# EAGLE board Controller-Board_Rack-PDU_1.0 (EAGLE 9.6.2)
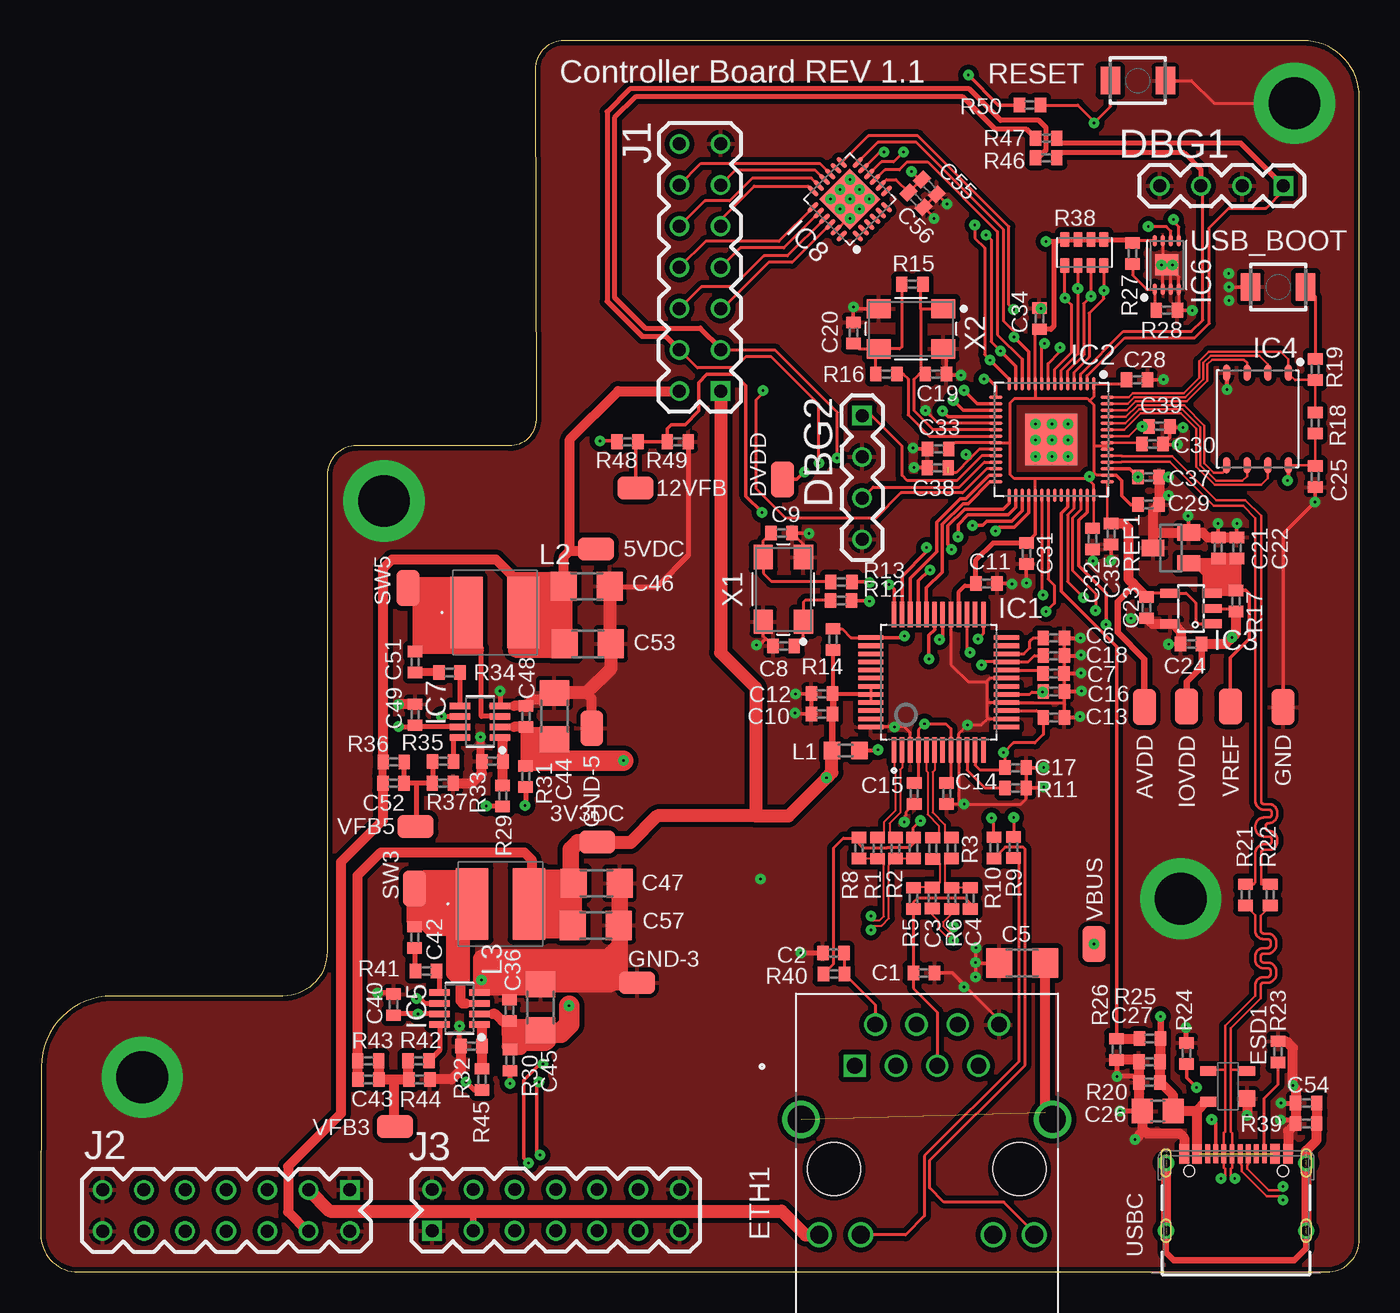
[diagram p3: board, top side]
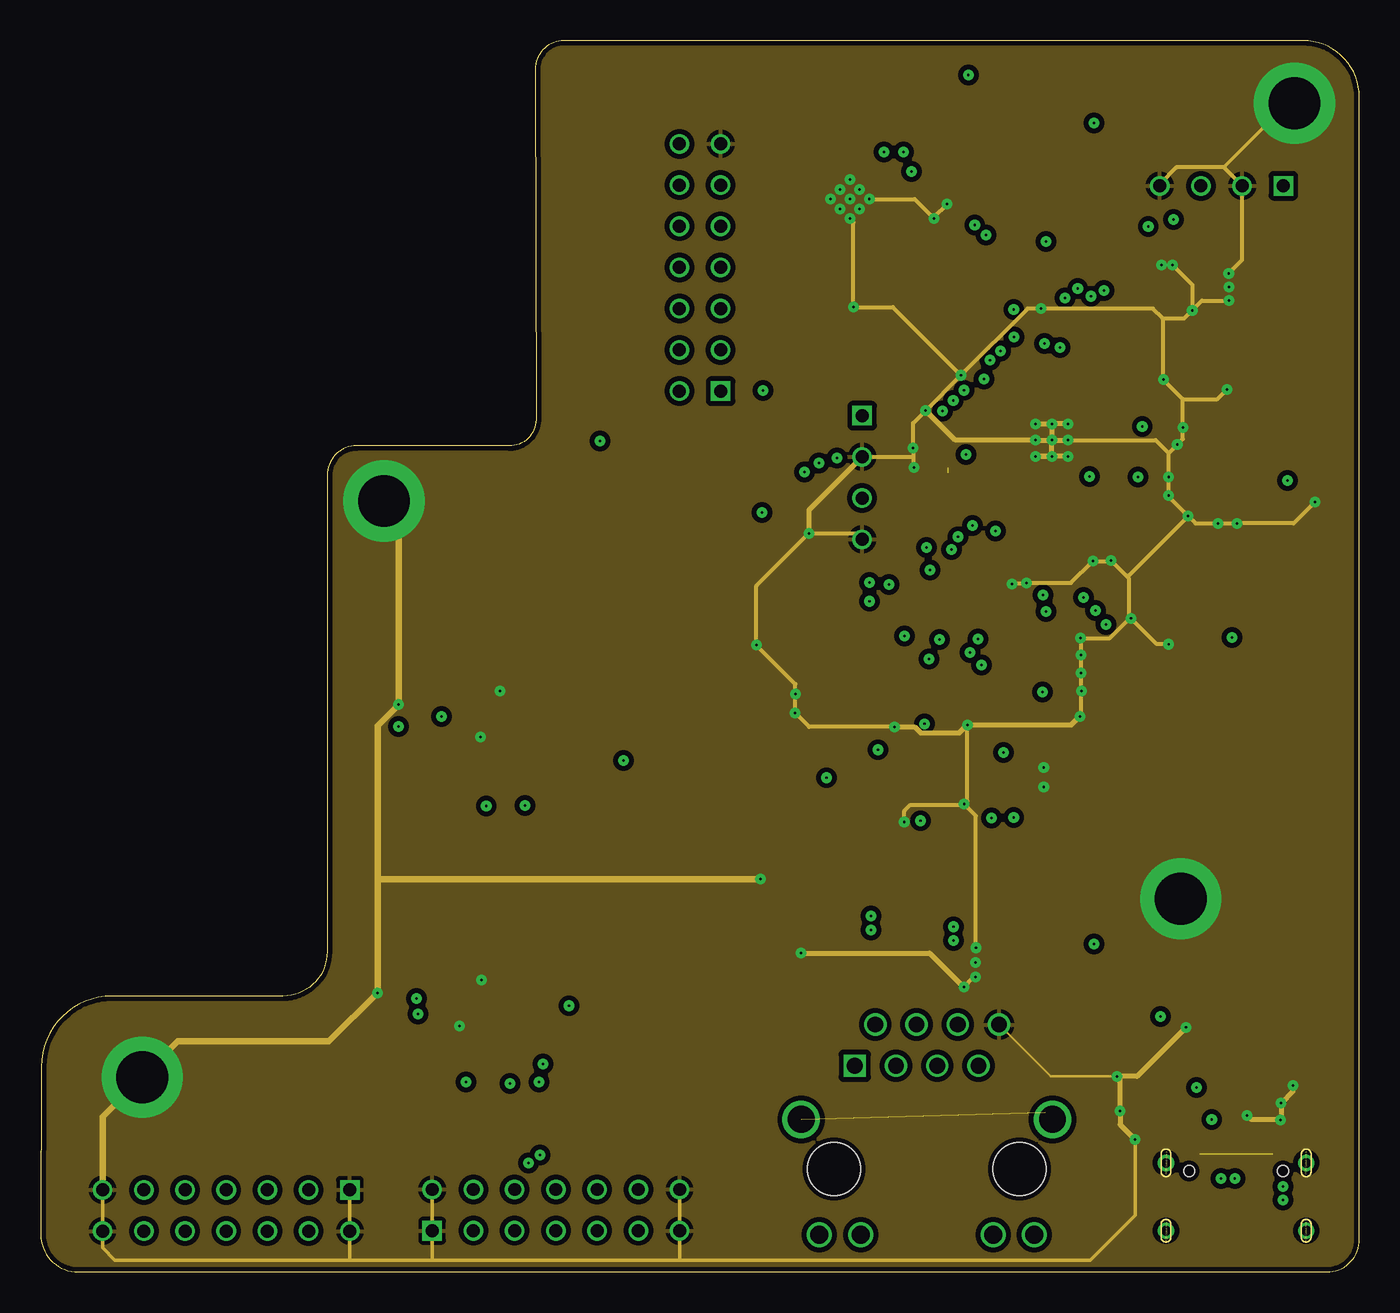
[diagram p4: board, inner layer Route2]
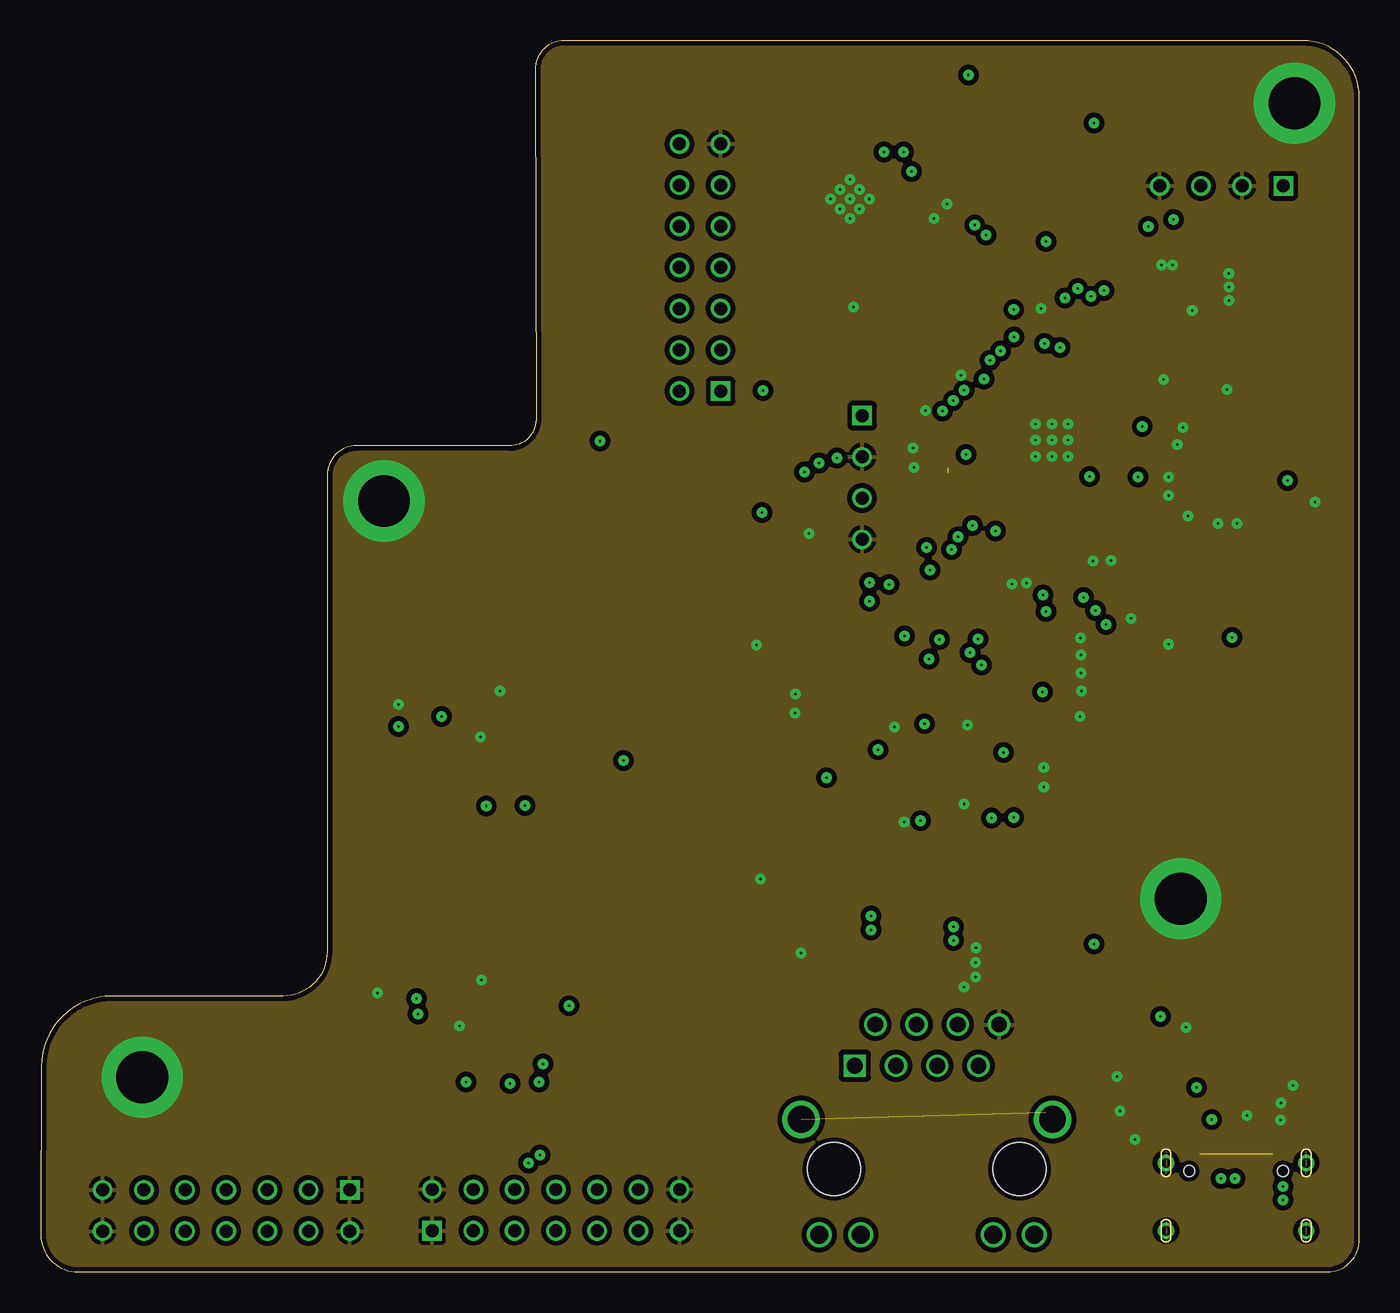
[diagram p5: board, inner layer Route15]
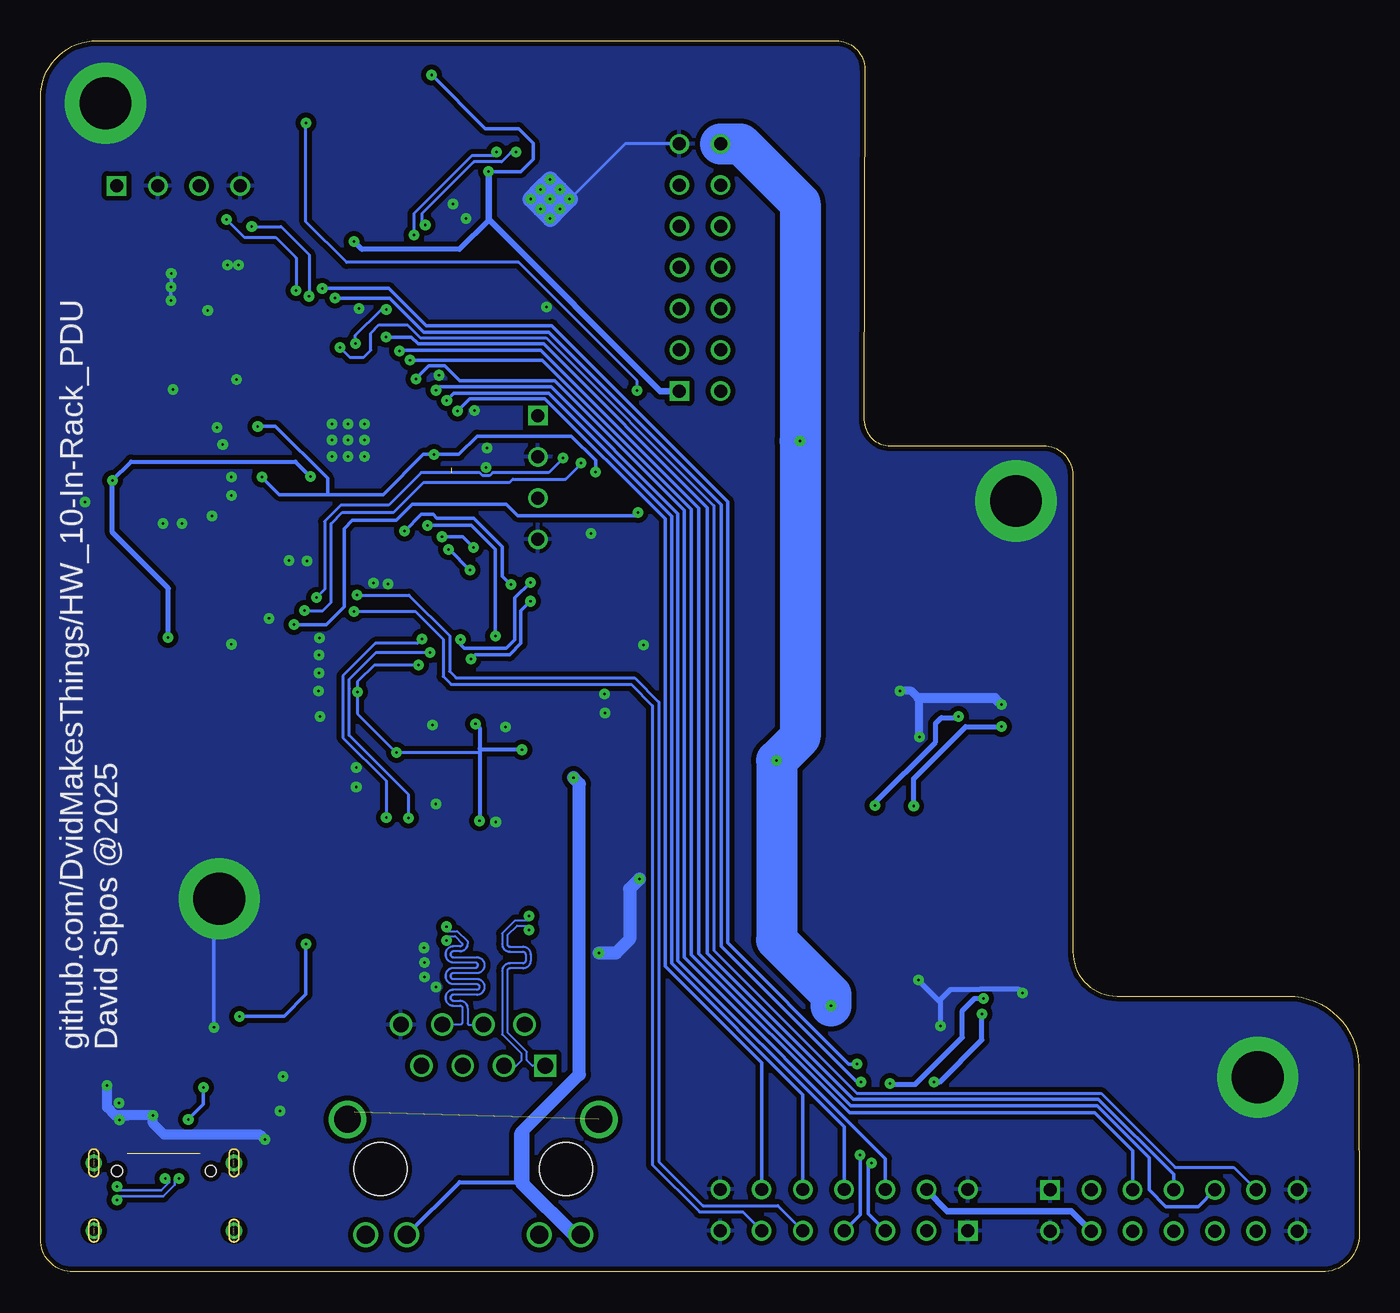
[diagram p6: board, bottom side, seen from below]

Size 81.26 x 75.87 mm. Coordinates in mm from the lower left corner, seen from the top.
Outline: 19.46,50.9 arc90 17.66,49.09 17.66,19.73 arc-90 14.93,17 4.41,17 arc90 0.05,12.65 0.01,2.31 0,2.31 arc90 2.31,0 79.26,0 arc90 81.26,2 81.26,72.39 arc90 77.78,75.87 32.24,75.87 arc90 30.48,74.11 30.53,52.5 arc-90 28.88,50.9 19.46,50.9
Copper layers (1+2*15+16): Top 0.035mm / dielectric 0.15mm / Route2 0.0175mm / dielectric 1.265mm / Route15 0.0175mm / dielectric 0.15mm / Bottom 0.035mm
Design rules "4layers *": minimum track width 3.5mil, minimum drill 0.15mm, track to track 3.5mil, track to pad 3.5mil, pad to pad 3.5mil, via to via 3.5mil, smd to smd 3.5mil, copper to edge 0.2mm, drill to drill 6mil, minimum pad ring 8mil, minimum via ring 0.25mm, stop-mask expansion 0.05mm, vias tented up to drill 16mil, thermal gap 10mil
Net classes: 1 100R_DIFFPAIR: width 0.121 mm, drill 0.15 mm, clearance 0.191 mm; 2 90R_DIFFPAIR: width 0.155 mm, drill 0.15 mm, clearance 0.191 mm

## Footprints (pad centres in the part's own frame; a part is rotated, then mirrored left to right if it is on the bottom)
TP = smd 2.2 x 1.4: TP 0,0
C0402 = smd 0.7 x 0.9: 1 -0.65,0; 2 0.65,0
C1206 = smd 1.6 x 1.803: 1 -1.422,0; 2 1.422,0
0805 = smd 1.3 x 1.5: 1 -0.95,0; 2 0.95,0
0402 = smd 0.7 x 0.9: 1 -0.65,0; 2 0.65,0
1X4 = drill 0.8 square: 1 0,3.81 | drill 0.8: 2 0,1.27; 3 0,-1.27; 4 0,-3.81
SOT143 = smd 1 x 1: 1 -0.75,-1.2 | smd 0.6 x 1: 2 0.95,-1.2; 3 0.95,1.2; 4 -0.95,1.2
RJ45-CAT5 = drill 0.97 square: 1 -4.445,6.35 | drill 0.97: 2 -3.175,8.89; 3 -1.905,6.35; 4 -0.635,8.89; 5 0.635,6.35; 6 1.905,8.89; 7 3.175,6.35; 8 4.445,8.89 | drill 1.1: 9 -6.625,-4.06; 10 -4.085,-4.06; 11 4.085,-4.06; 12 6.625,-4.06 | drill 1.65: S1 -7.745,3.05; S2 7.745,3.05 | hole 3.25: 5.715,0; -5.715,0
LQFP48 = smd 1.56 x 0.28: 1 -4.18,2.75; 2 -4.18,2.25; 3 -4.18,1.75; 4 -4.18,1.25; 5 -4.18,0.75; 6 -4.18,0.25; 7 -4.18,-0.25; 8 -4.18,-0.75; 9 -4.18,-1.25; 10 -4.18,-1.75; 11 -4.18,-2.25; 12 -4.18,-2.75; 25 4.18,-2.75; 26 4.18,-2.25; 27 4.18,-1.75; 28 4.18,-1.25; 29 4.18,-0.75; 30 4.18,-0.25; 31 4.18,0.25; 32 4.18,0.75; 33 4.18,1.25; 34 4.18,1.75; 35 4.18,2.25; 36 4.18,2.75 | smd 0.28 x 1.56: 13 -2.75,-4.18; 14 -2.25,-4.18; 15 -1.75,-4.18; 16 -1.25,-4.18; 17 -0.75,-4.18; 18 -0.25,-4.18; 19 0.25,-4.18; 20 0.75,-4.18; 21 1.25,-4.18; 22 1.75,-4.18; 23 2.25,-4.18; 24 2.75,-4.18; 37 2.75,4.18; 38 2.25,4.18; 39 1.75,4.18; 40 1.25,4.18; 41 0.75,4.18; 42 0.25,4.18; 43 -0.25,4.18; 44 -0.75,4.18; 45 -1.25,4.18; 46 -1.75,4.18; 47 -2.25,4.18; 48 -2.75,4.18
QFN40P700X700X100-57T510 = smd 0.837 x 0.22: 1 -3.437,2.6; 2 -3.437,2.2; 3 -3.437,1.8; 4 -3.437,1.4; 5 -3.437,1; 6 -3.437,0.6; 7 -3.437,0.2; 8 -3.437,-0.2; 9 -3.437,-0.6; 10 -3.437,-1; 11 -3.437,-1.4; 12 -3.437,-1.8; 13 -3.437,-2.2; 14 -3.437,-2.6; 29 3.437,-2.6; 30 3.437,-2.2; 31 3.437,-1.8; 32 3.437,-1.4; 33 3.437,-1; 34 3.437,-0.6; 35 3.437,-0.2; 36 3.437,0.2; 37 3.437,0.6; 38 3.437,1; 39 3.437,1.4; 40 3.437,1.8; 41 3.437,2.2; 42 3.437,2.6 | smd 0.22 x 0.837: 15 -2.6,-3.437; 16 -2.2,-3.437; 17 -1.8,-3.437; 18 -1.4,-3.437; 19 -1,-3.437; 20 -0.6,-3.437; 21 -0.2,-3.437; 22 0.2,-3.437; 23 0.6,-3.437; 24 1,-3.437; 25 1.4,-3.437; 26 1.8,-3.437; 27 2.2,-3.437; 28 2.6,-3.437; 43 2.6,3.437; 44 2.2,3.437; 45 1.8,3.437; 46 1.4,3.437; 47 1,3.437; 48 0.6,3.437; 49 0.2,3.437; 50 -0.2,3.437; 51 -0.6,3.437; 52 -1,3.437; 53 -1.4,3.437; 54 -1.8,3.437; 55 -2.2,3.437; 56 -2.6,3.437 | smd 3.2 x 3.2: 57 0,0
SOT23-5 = smd 0.55 x 1.2: 1 -0.95,-1.3; 2 0,-1.3; 3 0.95,-1.3; 4 0.95,1.3; 5 -0.95,1.3
SON127P600X500X75-8N = smd 1.012 x 0.432: 1 -2.85,1.905; 2 -2.85,0.635; 3 -2.85,-0.635; 4 -2.85,-1.905; 5 2.85,-1.905; 6 2.85,-0.635; 7 2.85,0.635; 8 2.85,1.905
SOT65P280X110-8N = smd 1.259 x 0.4: 1 -1.228,0.975; 2 -1.228,0.325; 3 -1.228,-0.325; 4 -1.228,-0.975; 5 1.228,-0.975; 6 1.228,-0.325; 7 1.228,0.325; 8 1.228,0.975
SON50P300X200X50-9T130X140N = smd 0.711 x 0.27: 1 -1.501,0.75; 2 -1.501,0.25; 3 -1.501,-0.25; 4 -1.501,-0.75; 5 1.501,-0.75; 6 1.501,-0.25; 7 1.501,0.25; 8 1.501,0.75 | smd 1.3 x 1.4: 9 0,0
QFN50P400X400X100-25T265 = smd 0.811 x 0.264: 1 -1.951,1.25; 2 -1.951,0.75; 3 -1.951,0.25; 4 -1.951,-0.25; 5 -1.951,-0.75; 6 -1.951,-1.25; 13 1.951,-1.25; 14 1.951,-0.75; 15 1.951,-0.25; 16 1.951,0.25; 17 1.951,0.75; 18 1.951,1.25 | smd 0.264 x 0.811: 7 -1.25,-1.951; 8 -0.75,-1.951; 9 -0.25,-1.951; 10 0.25,-1.951; 11 0.75,-1.951; 12 1.25,-1.951; 19 1.25,1.951; 20 0.75,1.951; 21 0.25,1.951; 22 -0.25,1.951; 23 -0.75,1.951; 24 -1.25,1.951 | smd 2.65 x 2.65: 25 0,0
2X7 = drill 0.8 square: 1 -1.27,7.62 | drill 0.8: 2 1.27,7.62; 3 -1.27,5.08; 4 1.27,5.08; 5 -1.27,2.54; 6 1.27,2.54; 7 -1.27,0; 8 1.27,0; 9 -1.27,-2.54; 10 1.27,-2.54; 11 -1.27,-5.08; 12 1.27,-5.08; 13 -1.27,-7.62; 14 1.27,-7.62
0603 = smd 1 x 1.1: 1 -0.85,0; 2 0.85,0
SRR5228A = smd 4.4 x 2: 1 0,1.75; 2 0,-1.75
742C083103JP = smd 0.59 x 0.92: 1 -1.2,-0.8; 2 -0.4,-0.8; 3 0.4,-0.8; 4 1.2,-0.8; 5 1.2,0.8; 6 0.4,0.8; 7 -0.4,0.8; 8 -1.2,0.8
SOT23 = smd 1 x 1.4: 1 -0.95,-1.1; 2 0.95,-1.1; 3 0,1.1
SWITCH-OMRON_B3U-1000P = smd 1.2 x 1.7: 1 -1.7,0; 2 1.7,0
629722000214 = smd 0.3 x 1.15: A1 -3.35,4.745; A4 -2.55,4.745; A5 -1.25,4.745; A6 -0.25,4.745; A7 0.25,4.745; A8 1.25,4.745; A9 2.55,4.745; A12 3.35,4.745; B1 3.05,4.745; B4 2.25,4.745; B5 1.75,4.745; B6 0.75,4.745; B7 -0.75,4.745; B8 -1.75,4.745; B9 -2.25,4.745; B12 -3.05,4.745 | drill 0.6 pad 1: S1 -4.32,4.18; S2 4.32,4.18; S3 -4.32,0; S4 4.32,0 | hole 0.65: -2.89,3.68; 2.89,3.68
OSCCC500X320X130 = smd 1.487 x 1.187: 1 -1.988,-1.238; 2 1.988,-1.238; 3 1.988,1.238; 4 -1.988,1.238

## Placement (x,y rotation side)
3V3DC  TP  [TP]  34.3,26.49 180 top
5VDC  TP  [TP]  34.23,44.55 0 top
12VFB  TP  [TP]  36.66,48.3 0 top
AVDD  TP  [TP]  68.01,34.81 270 top
C1  100nF  [C0402]  54.43,18.42 0 top
C2  22nF  [C0402]  48.85,19.64 180 top
C3  6.8nF  [C0402]  54.94,23.04 270 top
C4  6.8nF  [C0402]  56.14,23.02 270 top
C5  C1206C102KGRACTM  [C1206]  60.48,19.03 0 top
C6  100nF  [C0402]  62.43,39.07 0 top
C7  4.7uF  [C0402]  62.41,36.88 0 top
C8  18pF  [C0402]  45.78,38.57 180 top
C9  18pF  [C0402]  45.65,45.53 0 top
C10  100nF  [C0402]  48.14,34.38 180 top
C11  100nF  [C0402]  58.28,42.42 0 top
C12  100nF  [C0402]  48.14,35.63 180 top
C13  100nF  [C0402]  62.43,34.17 0 top
C14  100nF  [C0402]  55.83,29.48 270 top
C15  100nF  [C0402]  53.83,29.48 270 top
C16  100nF  [C0402]  62.43,35.77 0 top
C17  100nF  [C0402]  60.08,31.07 0 top
C18  100nF  [C0402]  62.43,37.97 0 top
C19  15pF  [C0402]  55.16,55.32 0 top
C20  15pF  [C0402]  50.08,57.86 90 top
C21  1uF  [C0402]  72.57,44.61 90 top
C22  100nF  [C0402]  73.71,44.61 90 top
C23  100nF  [C0402]  68.15,40.93 270 top
C24  100nF  [C0402]  70.89,38.69 180 top
C25  100nF  [C0402]  78.54,49 270 top
C26  10uF  [0805]  68.83,9.91 180 top
C27  100nF  [0402]  68.33,12.95 180 top
C28  100nF  [C0402]  67.56,54.97 0 top
C29  100nF  [C0402]  68.27,47.28 0 top
C30  100nF  [C0402]  68.5,51.01 0 top
C31  100nF  [C0402]  60.74,44.27 270 top
C32  100nF  [C0402]  64.82,45.17 270 top
C33  100nF  [C0402]  55.3,50.72 180 top
C34  100nF  [C0402]  61.54,58.73 90 top
C35  100nF  [C0402]  65.96,45.47 270 top
C36  100nF  [0402]  28.9,16.12 90 top
C37  100nF  [C0402]  68.27,48.98 0 top
C38  100nF  [C0402]  55.28,49.55 180 top
C39  100nF  [C0402]  68.93,52.1 0 top
C40  100nF  [0402]  21.75,16.47 90 top
C42  100nF  [0402]  23.05,20.62 90 top
C43  33pF  [0402]  20.2,11.86 0 top
C44  CL31A226KAHNNNE - 22uF 25V  [C1206]  31.66,34.25 90 top
C45  CL31A226KAHNNNE - 22uF 25V  [C1206]  30.81,16.3 90 top
C46  CL31A226KPHNNNE - 22uF - 10V  [C1206]  33.66,42.25 0 top
C47  CL31A226KPHNNNE - 22uF - 10V  [C1206]  34.26,23.95 0 top
C48  100nF  [0402]  29.91,34.23 90 top
C49  100nF  [0402]  23.08,34.33 90 top
C51  100nF  [0402]  23.08,37.58 90 top
C52  33pF  [0402]  21.74,30.11 0 top
C53  CL31A226KPHNNNE - 22uF - 10V  [C1206]  33.71,38.7 0 top
C54  4.7nF  [0402]  77.98,10.41 180 top
C55  100nF  [C0402]  54.76,66.86 315 top
C56  100nF  [C0402]  53.94,66.06 315 top
C57  CL31A226KPHNNNE - 22uF - 10V  [C1206]  34.21,21.35 0 top
DBG1  [1X4]  72.77,66.92 270 top
DBG2  [1X4]  50.62,48.95 0 top
DVDD  TP  [TP]  45.71,48.83 90 top
ESD1  SP0503BAHTG-ES  [SOT143]  73.15,11.43 90 top
ETH1  SI-60118-F  [RJ45-CAT5]  54.61,6.35 0 top
GND  TP  [TP]  76.56,34.8 270 top
GND-3  TP  [TP]  36.75,17.82 180 top
GND-5  TP  [TP]  33.96,33.5 270 top
IC1  W5500  [LQFP48]  55.33,36.33 90 top
IC2  RP2040  [QFN40P700X700X100-57T510]  62.28,51.29 270 top
IC3  MCP6001R  [SOT23-5]  70.89,40.88 90 top
IC4  W25Q128JVPIQ  [SON127P600X500X75-8N]  74.98,52.56 270 top
IC5  MP2315S  [SOT65P280X110-8N]  25.81,16.23 180 top
IC6  CAT24C256HU4IGT3  [SON50P300X200X50-9T130X140N]  69.39,62.05 90 top
IC7  MP2315GJ-Z  [SOT65P280X110-8N]  27.08,33.91 180 top
IC8  MCP23S18-E/MJ  [QFN50P400X400X100-25T265]  49.86,66.1 135 top
IOVDD  TP  [TP]  70.61,34.85 270 top
J1  [2X7]  40.63,61.89 180 top
J2  [2X7]  11.44,3.79 270 top
J3  [2X7]  31.75,3.81 90 top
L1  BLM18EG221TN1D  [0603]  49.61,32.13 0 top
L2  4.9uH  [SRR5228A]  27.99,40.63 90 top
L3  4.2uH  [SRR5228A]  28.34,22.68 90 top
R1  3.3R  [0402]  51.57,26.11 270 top
R2  3.3R  [0402]  52.67,26.11 270 top
R3  3.3R  [0402]  56.12,26.12 270 top
R4  3.3R  [0402]  54.97,26.1 270 top
R5  49.9R  [C0402]  53.78,23.02 90 top
R6  49.9R  [C0402]  57.28,23.02 90 top
R7  49.9R  [0402]  53.78,26.12 90 top
R8  49.9R  [0402]  50.43,26.12 90 top
R9  470R  [0402]  59.94,26.16 270 top
R10  470R  [0402]  58.74,26.14 270 top
R11  12.4K 1%  [0402]  60.08,29.82 180 top
R12  0R  [0402]  49.32,41.37 0 top
R13  1M  [0402]  49.34,42.52 0 top
R14  4.7K  [0402]  48.82,38.98 270 top
R15  0R  [0402]  53.71,60.85 180 top
R16  1K  [0402]  52.11,55.32 0 top
R17  4.7K  [0402]  73.66,41.33 270 top
R18  DNI  [0402]  78.54,52.31 270 top
R19  1K  [0402]  78.54,55.61 270 top
R20  2.2K 1%  [0402]  68.33,11.68 180 top
R21  27R  [0402]  74.24,23.24 90 top
R22  27R  [0402]  75.76,23.24 90 top
R23  5.1K  [0402]  76.25,13.56 90 top
R24  5.1K  [0402]  70.61,13.46 90 top
R25  10K  [0402]  68.35,14.38 180 top
R26  10K  [0402]  66.29,13.72 270 top
R27  4.7K  [0402]  67.28,62.76 90 top
R28  4.7K  [0402]  69.39,59.25 180 top
R29  100K  [0402]  28.47,29.33 90 top
R30  499K  [0402]  28.92,13.05 270 top
R31  499K  [0402]  29.89,30.53 270 top
R32  7.5K  [0402]  26.55,13.91 180 top
R33  9.09K  [0402]  27.84,31.46 180 top
R34  10R  [0402]  25.2,36.94 0 top
R35  20K  [0402]  24.8,31.46 180 top
R36  40.2K  [0402]  21.76,31.43 0 top
R37  7.5K  [0402]  24.78,30.11 0 top
R38  4D03WGJ0332T5E  [742C083103JP]  64.31,62.81 0 top
R39  1M  [0402]  77.98,9.14 180 top
R40  470R  [0402]  48.88,18.35 180 top
R41  10R  [0402]  23.75,18.54 0 top
R42  33K  [0402]  23.29,13.01 180 top
R43  40.2K  [0402]  20.19,13.01 0 top
R44  12.7K  [0402]  23.34,11.86 0 top
R45  100K  [0402]  27.2,11.87 90 top
R46  0R  [0402]  61.96,68.65 0 top
R47  0R  [0402]  61.96,69.85 0 top
R48  100K  [0402]  36.16,51.15 180 top
R49  10K  [0402]  39.26,51.15 180 top
R50  10K  [0402]  60.96,71.9 0 top
REF1  LM4040BXX  [SOT23]  69.65,44.61 90 top
RESET  B3U-1000P-B  [SWITCH-OMRON_B3U-1000P]  67.61,73.4 0 top
SW3  TP  [TP]  23.04,23.63 90 top
SW5  TP  [TP]  22.63,42.13 90 top
USB_BOOT  B3U-1000P-B  [SWITCH-OMRON_B3U-1000P]  76.25,60.69 180 top
USBC  USB-TYPE-C-018  [629722000214]  73.66,2.54 0 top
VBUS  TP  [TP]  64.91,20.21 90 top
VFB3  TP  [TP]  21.84,8.96 0 top
VFB5  TP  [TP]  23.11,27.45 180 top
VREF  TP  [TP]  73.31,34.85 270 top
X1  XC53M4-25.000-F18NJDTL  [OSCCC500X320X130]  45.76,42.06 90 top
X2  K5A1200015304P  [OSCCC500X320X130]  53.64,58.11 180 top

## Tracks (layer width: path | path; a pad name or v marks a point on that pad's centre or on a via)
!ACT  (via drill 0.15)
  Top 0.2: R10.1 58.74,27.82 v58.58,27.98 | v57.26,38.17 57.08,38.35 IC1.27
  Bottom 0.2: v58.58,27.98 58.58,29.4 62.25,33.06 62.25,35.94 62.23,35.95 62.23,36.52 60.58,38.17 v57.26,38.17
!INT  (via drill 0.15)
  Top 0.203: IC1.36 52.58,42.05 v52.28,42.35 | v58.83,45.65 59.06,45.88 59.98,45.88 60.88,46.77 IC2.32
  Bottom 0.203: v52.28,42.35 52.81,42.88 52.81,44.67 54.58,46.45 56.83,46.45 57.06,46.67 57.81,46.67 v58.83,45.65
!LINK  (via drill 0.15)
  Top 0.2: IC1.25 58.08,39.32 v57.76,39 | v59.96,28 59.96,26.82 R9.1
  Bottom 0.2: v57.76,39 58.03,38.73 60.63,38.73 62.63,36.73 62.63,32.92 59.96,30.25 v59.96,28
!QSPI_SS
  Top 0.155: IC2.56 67.04,53.89 67.29,54.13 70.43,54.13 71.39,55.1 71.39,56.12 71.98,56.7 76.42,56.7 76.88,56.24 IC4.1 76.88,55.35 77.29,54.95 77.3,54.96 R19.2 R18.1
!RST  (via drill 0.15)
  Top 0.2: R14.1 49.38,39.63 49.93,39.08 IC1.37
  Top 0.203: IC2.31 60.48,46.9 59.83,46.25 58.31,46.25 58.06,46 v57.41,46 | v53.23,39.17 53.14,39.08 IC1.37
  Bottom 0.203: v57.41,46 54.71,46 53.23,44.52 v53.23,39.17
!SPI0_CS
  Top 0.203: IC2.28 58.49,48.69 57.14,47.34 56.84,47.34 55.56,46.06 55.56,43.12 54.58,42.15 IC1.32
!SPI1_CS
  Top 0.2: IC8.9 52.02,67.9 52.92,67.9 53.41,68.4 54.66,68.4 58.96,64.1 58.96,57.75 60.48,56.23
  Top 0.203: IC2.12 60.48,56.23
!SPI1_CS_S  (via drill 0.15)
  Top 0.2: IC2.8 62.08,55.97 62.81,56.7 v62.81,56.95
  Bottom 0.2: v62.81,56.95 62.21,56.35 61.36,56.35 60.91,56.8 60.91,57.85 60.41,58.35 58.66,58.35 57.86,57.55 50.11,57.55 39.78,47.22 39.78,19.82 30.96,11 15.91,11 11.36,6.45 7.75,6.45 J2.11
+1V1  (via drill 0.15)  (1 unrouted)
  Top 0.152: IC2.50 67.05,51.49 67.66,52.1 v67.88,52.1
  Top 0.2: IC2.23 57.85,50.69 57.28,50.12 56.41,49.25 55.93,49.25
  Top 0.203: IC2.45 67.11,49.49 C37.1 | 57.28,50.12 v57.02,50.38 | v47.06,49.3 46.59,48.83 DVDD.TP | C39.1 v67.88,52.1
  Bottom 0.203: v47.06,49.3 47.06,50 48.56,51.5 54.36,51.5 55.48,50.38 v57.02,50.38 57.68,50.38 60.16,47.9 63.58,47.9 | C37.1 66.54,47.9 63.58,47.9 | v67.88,52.1 66.79,52.1 63.58,48.89 63.58,47.9
  other vias: 67.62,48.98
+3V3  (via drill 0.15)
  Top 0.152: IC2.49 67.77,51.09 C30.1 | IC2.42 64.88,45.88 C32.1
  Top 0.155: R18.2 C25.1 78.48,49.71 IC4.8
  Top 0.2: C28.1 66.67,54.73 IC2.1 64.88,53.91 64.64,53.68 | C34.1 61.28,57.82 IC2.10 61.28,53.85 61.26,53.83 | IC2.48 65.72,50.88 | 65.72,50.88 IC2.49 | 59.74,51.09 59.74,49.13 59.99,48.88 61.26,48.88 | 59.74,51.09 59.74,53.55 60.02,53.83 61.26,53.83 | 61.26,53.83 64.49,53.83 64.64,53.68 | 64.9,50.93 64.9,53.42 64.64,53.68 | 64.9,50.93 64.9,49.26 | 64.9,49.26 v64.64,49 64.52,48.88 | 64.52,48.88 61.26,48.88 | 64.9,49.26 65.06,49.09 IC2.44 | 65.72,50.88 64.95,50.88 64.9,50.93 | 59.74,51.09 IC2.22 56.33,51.09 C33.1 | IC2.33 61.28,48.86 61.26,48.88 | R38.8 R38.7 R38.6 R38.5 65.56,63.61 67.08,63.61 | IC6.8 67.42,63.55 R27.2 | IC3.2 73.47,40.88 R17.2 | IC1.43 IC1.44 IC1.45 | 57.48,42.27 57.5,42.29 C11.1 | IC2.42 64.88,48.51 64.52,48.88 | IC8.8 52.12,67.3 52.7,67.3 C56.1 54.28,67.32 C55.1 54.14,67.32 v53.66,67.8
  Top 0.203: IC2.33 61.28,45.46 C31.1 | IC2.44 66.28,49.09 66.62,48.75 66.62,47.82 67.16,47.28 C29.1 | R50.1 59.01,71.9 v57.16,73.75
  Top 0.254: L1.1 48.76,34.35 C10.1 48.79,34.5 C12.1 | IC1.44 48.84,35.58 C12.1 | R14.2 48.82,35.66 C12.1 | IC1.28 56.58,41.92 56.95,42.29 57.5,42.29 | R38.8 62.77,63.61 62.46,63.3 | IC4.8 76.88,48.83 v76.83,48.77
  Top 0.305: v61.96,63.5 62.66,63.5 62.77,63.61 | R38.8 65.56,63.61 | R38.5 67.08,63.61 R27.2 | 62.46,63.3 62.43,63.28 62.43,58.27 62.24,58.08 C34.1 | C11.1 57.63,43.87 58.68,44.92 C31.1
  Top 0.406: 17.83,3.75 26.66,3.75 | 26.66,3.75 45.66,3.75 | J3.3 26.67,3.74 26.66,3.75 | L1.1 48.79,32.16 48.79,34.5 | C10.1 48.84,34.43 48.84,35.58 | IOVDD.TP 70.61,36.35 71.56,37.3 71.56,38.67 C24.1
  Top 0.61: C24.1 73.02,38.69 v73.42,39.09 73.66,39.33 R17.2 | C43.1 R43.1 19.54,24.43 20.96,25.85 29.81,25.85 30.26,25.4 30.26,22.85 30.43,22.68
  Top 0.813: J1.1 41.9,38.16 44.06,36 44.06,28.1 | J2.3 17.83,3.75 45.66,3.75 47.12,2.29 ETH1.9 | L1.1 48.76,30.77 v48.43,30.45 46.08,28.1 44.06,28.1 | 44.06,28.1 38.01,28.1 36.36,26.45 34.34,26.45 3V3DC.TP
  Top 1.016: C47.1 32.49,24.3 30.86,24.3 30.86,21.05 | 30.81,21 30.86,21.05 | 30.86,21.05 32.01,21.05 32.01,23.45 31.71,23.75 31.36,23.75 31.36,21.75 30.43,22.68 L3.2 | C57.1 32.84,21.4 C47.1 | 3V3DC.TP 33.1,26.49 32.66,26.05 32.66,24.13 C47.1
  Bottom 0.2: v73.42,39.09 v73.41,39.1 73.38,39.1
  Bottom 0.203: v57.16,73.75 53.86,70.45 51.81,70.45 50.91,69.55 50.91,68.55 51.66,67.8 v53.66,67.8
  Bottom 0.254: ETH1.9 51.23,5.54 | 51.23,5.54 51.23,9 48.06,12.18 | 51.23,5.54 51.66,5.54 55.44,5.54 ETH1.11 | v76.83,48.77 75.69,49.92 65.56,49.92 v64.64,49
  Bottom 0.305: 73.38,39.1 73.38,42.12 76.83,45.58 v76.83,48.77 | v53.66,67.8 53.66,64.8 55.46,63 61.46,63 v61.96,63.5
  Bottom 0.406: J1.1 43.08,54.27 53.66,64.85 v53.66,67.8
  Bottom 0.813: ETH1.9 48.41,2.29 51.66,5.54 51.66,8.57 48.06,12.18 48.06,30.07 v48.43,30.45
+3V3_A  (via drill 0.15)
  Top 0.2: C15.1 54.08,30.38 IC1.4 54.08,33.4 v54.46,33.77 55.78,33.77 56.08,33.48 IC1.8 56.08,30.38 C14.1 | IC1.15 61.37,34.58 C13.1 61.78,33.12 61.26,32.6 59.93,32.6 v59.33,32 59.43,31.91 C17.1 59.31,30.95 57.86,30.95 57.58,31.23 IC1.11 | IC1.17 60.93,35.58 61.08,35.73 v61.73,35.73 C16.1 | C18.1 61.23,37.97 60.84,37.58 IC1.21 58.17,37.58 v57.98,37.4 | 50.43,26.73 50.43,26.36 50.67,26.12 52.14,26.12 53.51,26.12 53.78,26.39 R7.2 53.78,27.37 v54.21,27.8 | 50.43,26.73 R8.2 | R40.2 48.86,18.98 48.86,26.12 49.46,26.73 50.43,26.73
  Top 0.254: L1.2 51.56,32.13 v51.61,32.17
  Bottom 0.2: 54.21,32.02 59.31,32.02 v59.33,32 61.73,34.4 v61.73,35.73 61.73,36.35 60.68,37.4 v57.98,37.4
  Bottom 0.254: v51.61,32.17 54.13,32.17 54.21,32.25 | 54.21,32.25 54.21,33.52 v54.46,33.77 | 54.21,32.25 54.21,32.02 v54.21,27.8
+5V
  Top 0.508: C52.1 21.09,31.41 R36.1
  Top 0.61: R36.1 21.11,43.35 21.66,43.9 28.06,43.9 29.26,42.7 | C46.1 32.24,44.08 32.61,44.45 | 32.61,44.45 34.13,44.45 5VDC.TP | C52.1 21.09,27.83 18.51,25.25 18.51,9.75 15.26,6.5 15.26,3.7 16.44,2.52 J2.4 | 32.61,44.45 32.61,51.3 35.58,54.27 J1.2
  Top 0.813: L2.2 29.46,40.35 29.21,40.35 29.21,38.3 29.26,38.25 31.71,38.25 31.71,42.6 | 31.71,42.6 31.61,42.7 29.26,42.7 29.21,42.65 29.66,42.2 31.21,42.2 31.21,38.8 31.11,38.7 31.01,38.8 30.96,38.8 30.96,41.7 31.26,41.4 32.36,41.4 32.36,39.3 32.29,39.23 C53.1 | C46.1 31.89,42.6 31.71,42.6
  Bottom 0.406: J2.4 17.75,3.75 25.39,3.75 26.67,5.04 J3.4
+12V  (via drill 0.15)
  Top 0.203: v34.46,51.2 35.46,51.2 R48.2
  Top 0.305: IC7.2 29.16,33.58 | 27.86,15.91 IC5.2
  Top 0.61: 29.89,33.25 R31.1 30.51,31.18 | 29.89,33.25 29.89,33.56 C48.1 29.16,33.58 | 30.51,31.18 30.96,31.18 | 30.96,31.18 31.44,31.18 | 31.44,31.18 31.86,31.6 31.86,32.63 C44.1 31.24,33.25 30.91,33.25 | 30.91,33.25 30.36,33.25 | 30.36,33.25 29.89,33.25 | 30.36,33.25 30.36,31.33 30.51,31.18 | 30.96,31.18 30.96,32.35 | 30.96,32.35 30.96,33.2 30.91,33.25 | 31.44,31.18 31.44,31.5 31.44,31.87 30.96,32.35 | C45.1 30.44,15.25 29.12,15.25 C36.1 | C36.1 28.44,15.47 28,15.91 27.86,15.91 | R30.1 28.92,14.85 | 28.72,14.65 28.72,15.29 C36.1 | R30.1 29.67,13.7 29.42,13.95 | 29.42,13.95 31.21,13.95 31.36,14.1 30.91,14.55 | 30.81,14.65 C45.1 | C45.1 28.95,14.88 28.92,14.85 | 28.92,14.85 28.72,14.65 | 28.72,14.65 29.04,14.33 | 29.04,14.33 29.42,13.95 | C45.1 30.26,14.33 29.04,14.33 | 28.72,14.65 28.72,13.9 R30.1
  Top 1.27: 31.44,31.5 v35.91,31.5 | 31.16,14.3 30.91,14.55 | 30.91,14.55 30.81,14.65 | v32.56,16.4 32.56,15.25 32.06,14.75 31.11,14.75 30.91,14.55
  Bottom 2.54: J1.14 38.12,69.51 34.46,65.85 v34.46,51.2 34.46,32.95 v35.91,31.5 35.91,20.45 32.56,17.1 v32.56,16.4
AVDD
  Top 0.152: IC2.43 65.72,46.37 C35.1
  Top 0.2: C23.1 68.4,41.83 IC3.4 70.58,41.83 71.17,41.23 71.17,40.11 71.36,39.93 IC3.1
  Top 0.406: AVDD.TP 68.01,37.75 66.36,39.4 66.36,41.3 67.39,42.33
  Top 0.61: C35.1 66.73,46.12 67.03,45.83 67.03,42.69 67.39,42.33 C23.1
CC1  (via drill 0.15)
  Top 0.203: USBC.A5 72.41,9.15 v72.16,9.4 | v71.22,11.35 70.61,11.96 R24.1
  Bottom 0.203: v72.16,9.4 71.22,10.34 v71.22,11.35
CC2
  Top 0.2: USBC.B5 75.41,10.72 76.25,11.55 R23.1
CHASSIS  (1 unrouted)
  Top 0.61: ETH1.S2 61.9,9.85 C5.2
DIO_RESET  (via drill 0.15)
  Top 0.2: IC2.9 61.68,57.02 v61.86,57.2 | v59.96,59.29 59.66,59.59 59.66,64.4 54.06,70 51,70 IC8.13
  Bottom 0.2: v61.86,57.2 61.86,57.7 60.27,59.29 v59.96,59.29
DP_N  (via drill 0.15)
  Top 0.155: 72.98,12.45 72.98,8.64 72.91,8.57 USBC.B7 72.91,6.43 72.99,6.35 72.99,5.75 v72.74,5.75 | R21.1 74.84,21.99 74.84,21.02 arc90 75.35,20.51 75.61,20.51 arc-90 75.78,20.33 75.78,20.13 arc-90 75.61,19.96 75.35,19.96 arc90 74.84,19.44 74.84,19.23 arc90 75.35,18.72 75.61,18.72 arc-90 75.78,18.54 75.78,18.34 arc-90 75.61,18.17 75.35,18.17 arc90 74.84,17.65 74.84,17.02 72.98,15.16 72.98,12.45 | ESD1.3 72.02,12.45 72.98,12.45 | USBC.A7 73.91,6.68 74.01,6.58 74.01,6.21 75.54,4.68 76.56,4.68 v76.56,4.43
  Bottom 0.155: v76.56,4.43 76.56,4.68 73.69,4.68 72.99,5.38 72.99,5.75 v72.74,5.75
DP_P  (via drill 0.15)
  Top 0.155: 73.33,12.45 73.33,8.64 73.41,8.55 USBC.A6 73.41,6.43 73.33,6.35 73.33,5.75 v73.58,5.75 | R22.1 75.76,22.54 75.18,21.95 75.18,21.02 arc90 75.35,20.85 75.61,20.85 arc-90 76.13,20.33 76.13,20.13 arc-90 75.61,19.61 75.35,19.61 arc90 75.18,19.44 75.18,19.23 arc90 75.35,19.06 75.61,19.06 arc-90 76.13,18.54 76.13,18.34 arc-90 75.61,17.82 75.35,17.82 arc90 75.18,17.65 75.18,16.88 73.33,15.02 73.33,12.45 | ESD1.2 74.29,12.45 73.33,12.45 | USBC.B6 74.41,6.63 74.36,6.58 74.36,6.34 75.68,5.02 76.56,5.02 v76.56,5.27
  Bottom 0.155: v76.56,5.27 76.56,5.02 73.83,5.02 73.33,5.52 73.33,5.75 v73.58,5.75
DSP_RES  (via drill 0.15)
  Top 0.2: IC2.34 61.68,41.78 v61.76,41.7
  Bottom 0.2: v61.76,41.7 58.56,41.7 56.06,39.2 56.06,37 55.66,36.6 44.66,36.6 43.17,35.11 43.17,6.8 40.46,4.09 35.84,4.09 J3.9
EXP_RST  (via drill 0.15)
  Top 0.2: IC2.35 62.08,42.68 62.46,42.3 62.46,41.2 v61.96,40.7
  Bottom 0.2: v61.96,40.7 58.17,40.7 56.46,38.99 56.46,36.7 55.96,36.2 44.86,36.2 43.56,34.9 43.56,6.6 40.66,3.7 37.99,3.7 J3.11
GND  (via drill 0.15, 3.2 pad 5)
  Top 0.2: USBC.B12 70.46,7.29 USBC.A1 | USBC.B1 76.86,7.29 USBC.A12 | IC6.7 69.14,62.3 69.35,62.08 | 69.35,62.08 IC6.9 69.64,61.8 | IC6.2 69.14,61.87 69.35,62.08 | IC6.3 69.64,61.8 | 69.64,61.8 70.14,61.3 IC6.4 70.14,59.35 R28.1 | 69.52,39.93 IC3.5 | 70.15,39.58 70.24,39.49 | 63.08,35.1 C16.2 63.06,35.79 C7.2 63.08,36.9 C18.2 C6.2 | 63.08,35.1 C13.2 | 63.08,35.1 63.06,35.08 IC1.16 58.34,35.08 58.31,35.05 | 56.54,28.83 C14.2 | 56.54,28.83 56.58,28.87 IC1.9 56.58,33.17 v57.11,33.7 57.96,33.7 58.38,34.12 | 56.54,28.83 60.39,28.83 60.73,29.17 R11.1 C17.2 | IC1.19 58.49,36.58 58.31,36.4 58.31,36.35 | IC1.14 58.43,34.08 58.38,34.12 | 58.31,36.35 58.31,35.05 | 58.31,35.05 58.31,34.2 58.38,34.12 | IC1.3 53.58,33.23 53.23,33.58 52.91,33.58 | v52.61,33.58 IC1.48 | IC1.29 56.08,37.43 57.16,36.35 58.31,36.35 | C8.2 44.69,39.01 44.53,39.18 X1.4 | C9.2 47,44.83 X1.2 47.37,43.68 | C15.2 53.32,28.32 53.32,28.14 53.21,28.04 v53.21,27.72 | 56.16,18.42 C1.2 56.15,18.42 59.09,15.48 59.05,15.44 ETH1.8 | IC2.19 55.32,52.29 v54.54,53.08 | IC8.23 49.86,65.04 IC8.25 | v55.06,64.9 55.06,64.94 C56.2 54.42,65.6 C55.2 55.26,66.4 v55.86,65.8 | RESET.2 70.91,73.4 72.31,72 v77.26,72
  Top 0.203: C28.2 v69.18,54.97 v69.19,54.98 | v70.38,52.02 69.66,52.02 C39.2 69.58,51.44 C30.2 69.19,50.98 v70.03,50.98 | C37.2 v69.51,48.98 | C29.2 69.48,47.85 v69.51,47.85 | C31.2 60.74,42.47 v60.76,42.45 | C32.2 64.82,43.81 v64.83,43.8 | C35.2 v65.96,43.83 | REF1.2 70.75,46.54 v70.71,46.58 | C21.2 72.57,46.09 v72.53,46.12 | C22.2 v73.71,46.12 | C25.2 v78.54,47.45 v78.53,47.45 76.56,45.48 GND.TP | C23.2 v67.19,40.28 v67.19,40.27 | C24.2 69.53,38.69 v69.51,38.67 | USB_BOOT.2 74.54,60.67 v73.23,60.67 | R28.1 v70.96,59.25 | v69.73,62.05 IC6.9 v69.06,62.05 | v61.63,59.35 61.6,59.38 C34.2 | C11.2 59.84,42.42 v59.86,42.4 | C33.2 53.82,50.72 v53.76,50.77 | 54.63,49.25 54.3,49.58 v53.81,49.58 | X2.4 55.81,56.69 C19.2 55.88,55.25 v56.71,55.25 | C20.2 v50.08,59.45 50.19,59.35 X2.2 | C9.2 46.33,45.5 v47.33,45.5 | v44.11,38.62 44.31,38.62 44.69,39.01 | C12.2 46.54,35.63 v46.51,35.6 | C10.2 46.55,34.38 v46.48,34.45 | 52.91,33.58 v52.61,33.58 | C17.2 v61.8,31.07 v61.81,31.08 | R11.1 61.75,29.82 v61.81,29.88 | 56.16,18.42 56.88,17.7 v56.88,17.55 56.88,17.71 56.18,18.42 C1.2 | v57.61,18.18 v57.61,19.07 | v57.61,19.07 57.61,19.95 v57.63,19.98 | v57.61,19.07 57.65,19.03 C5.1
  Top 0.254: C12.2 C10.2 | C6.2 63.1,39.05 v64.08,39.05 | C18.2 64.08,37.97 v64.11,38 | C7.2 64.09,36.88 v64.11,36.9 | C16.2 64.1,35.77 v64.13,35.8 | C13.2 63.98,34.17 v64.03,34.23 | IC4.4 73.08,54.41 v73.11,54.38
  Top 0.305: C2.2 v46.86,19.64 v46.86,19.65 | R24.2 70.58,14.14 v70.58,15.07 | R26.2 66.31,13.05 v66.31,12.05 67.31,12.05 R20.2 | C26.2 66.53,9.91 v66.51,9.93 | v76.44,10.4 77.31,10.4 C54.2 | v76.41,9.38 77.1,9.38 R39.2 | 29.16,34.88 IC7.4 v28.31,35.8 | R32.2 25.81,14 v25.81,15.15 | v27.16,18 27.19,17.97 27.19,17.55 | 27.04,17.55 IC5.4 28.96,17.2 | 28.96,17.2 30.29,17.2 C45.2 | C36.2 28.9,17.14 28.96,17.2 | C40.2 21.67,17.2 v20.76,17.2 | R49.1 39.91,44.15 37.96,42.2 35.13,42.2 C46.2
  Top 0.508: R33.2 27.11,31.54 v27.11,32.95 27.11,33
  Top 0.61: 76.86,7.29 76.86,8.68 R39.2 C54.2 77.33,11.32 v77.16,11.48 77.16,13.79 76.74,14.21 R23.2 | 67.88,8.82 C26.2 67.68,10.11 R20.2 C27.2 67.56,13.07 R26.2 | 67.88,8.82 68.17,8.53 70.18,8.53 70.46,8.26 70.46,7.29 | ESD1.1 v74.35,9.66 v74.35,9.65 | 67.88,8.82 67.88,8.6 v67.44,8.15 | C22.2 C21.2 71.89,45.26 71.59,45.56 REF1.2 68.61,45.56 | 68.61,45.56 68.55,45.5 REF1.3 68.55,45.52 | 68.55,45.52 68.55,46.91 C29.2 C37.2 | 68.61,45.56 68.58,45.56 68.55,45.52 | C23.2 68.5,39.93 69.52,39.93 | IC3.5 69.81,39.93 70.15,39.58 | 70.24,39.49 C24.2 | 29.16,34.88 C48.2 30.33,35.3 30.86,35.3 31.23,35.67 C44.2 | R37.2 26.57,30.11 27.19,30.73 R33.2 | C49.2 22.09,34.98 v22.06,34.95 | GND-5.TP 33.96,35.34 33.63,35.67 | R32.2 25.9,12.44 25.32,11.86 R44.2
  Top 0.813: C46.2 35.08,38.75 C53.2 35.13,37.17 33.63,35.67 C44.2
  Top 1.016: C47.2 35.68,21.4 | 35.68,21.4 C57.2 | C45.2 30.71,17.82 28.86,17.82 | 28.86,17.82 27.16,17.82 | v27.16,18 27.16,19.3 27.26,19.4 31.11,19.4 | 31.11,19.4 31.31,19.2 31.31,18.65 | 31.31,18.65 31.31,18.22 C45.2 | 31.11,19.4 34.96,19.4 35.68,20.12 | 35.68,20.12 35.68,21.4 | C45.2 35.08,17.72 35.68,18.32 35.68,18.65 | 35.68,18.65 35.68,20.12 | 35.68,18.65 31.96,18.65 32.75,17.86 GND-3.TP | 31.31,18.65 27.66,18.65 | 28.86,17.82 28.59,17.55 27.19,17.55
  Route2 0.152: ETH1.8 62.24,12.05 v66.31,12.05
  Route2 0.203: J2.13 J2.14 3.82,1.49 4.58,0.73 19.14,0.73 | J2.1 J2.2 19.06,0.8 19.14,0.73 | J3.2 J3.1 24.13,0.75 24.11,0.73 | 19.14,0.73 24.11,0.73 | 24.11,0.73 39.38,0.73 | 39.38,0.73 64.66,0.73 67.44,3.5 v67.44,8.15 | J3.14 J3.13 39.37,0.74 39.38,0.73 | 72.91,68.05 76.86,72 v77.26,72
  Route2 0.254: v56.88,17.55 57.51,18.18 v57.61,18.18 | v57.63,19.98 57.63,28.1 v56.91,28.82 | v53.21,27.72 53.21,28.41 53.58,28.77 56.86,28.77 v56.91,28.82 | v56.91,28.82 57.11,29.02 v57.11,33.7 | v52.61,33.58 47.35,33.58 v46.48,34.45 46.48,35.58 v46.51,35.6 46.51,36.23 v44.11,38.62 44.11,42.27 v47.33,45.5 50.26,45.5 DBG2.4 | v59.86,42.4 60.76,42.4 v60.76,42.45 63.48,42.45 v64.83,43.8 65.94,43.8 v65.96,43.83 67.03,42.75 | 67.15,40.31 67.03,40.42 67.03,42.75 | 67.15,40.31 v67.19,40.27 68.78,38.67 v69.51,38.67 | v64.08,39.05 64.13,39.05 | 64.13,39.05 65.88,39.05 67.15,40.31 | v64.03,34.23 64.13,34.33 v64.13,35.8 64.13,36.88 v64.11,36.9 v64.11,38 64.11,39.02 64.13,39.05 | 67.03,42.75 67.03,42.9 v70.71,46.58 | v70.71,46.58 69.51,47.77 v69.51,47.85 v69.51,48.98 69.51,50.45 | v70.71,46.58 71.16,46.12 v72.53,46.12 v73.71,46.12 77.21,46.12 v78.53,47.45 | 69.51,50.45 v70.03,50.98 70.38,51.33 v70.38,52.02 70.38,53.77 | 70.38,53.77 v69.19,54.98 69.19,58.7 69.13,58.75 | v63.31,51.25 68.71,51.25 69.51,50.45 | 53.76,50.23 v53.76,50.77 53.76,52.3 v54.54,53.08 v56.71,55.25 | 53.76,50.23 53.76,49.62 v53.81,49.58 | DBG2.2 53.75,50.22 53.76,50.23 | v56.71,55.25 52.51,59.45 v50.08,59.45 50.08,64.67 v49.86,64.9 | v56.71,55.25 60.81,59.35 v61.63,59.35 68.53,59.35 69.13,58.75 | 69.13,58.75 70.46,58.75 v70.96,59.25 | v69.73,62.05 70.96,60.83 v70.96,59.25 | v70.96,59.25 71.56,59.85 v73.23,59.85 | v73.21,61.52 74.04,62.35 DBG1.2 72.91,68.05 69.98,68.05 68.96,67.02 DBG1.4 | 70.38,53.77 72.51,53.77 v73.11,54.38 | v51.06,66.1 53.86,66.1 v55.06,64.9 55.06,65 v55.86,65.8
  Route2 0.305: DBG2.2 47.33,46.94 v47.33,45.5 | v54.54,53.08 56.36,51.25 v61.31,51.25 v62.31,51.25 | v62.31,51.25 v63.31,51.25 | v62.31,52.25 v62.31,51.25 | v62.31,51.25 v62.31,50.25 v61.31,50.25 v63.31,50.25 | v63.31,52.25 v62.31,52.25 | v61.31,52.25 v62.31,52.25 | v64.03,34.23 63.51,33.7 v57.11,33.7 56.62,33.21 54.22,33.21 53.85,33.58 v52.61,33.58 | v46.86,19.65 54.78,19.65 v56.88,17.55 | v70.58,15.07 67.56,12.05 v66.31,12.05 66.51,11.85 v66.51,9.93 66.51,9.08 v67.44,8.15 | v77.16,11.48 77.16,11.13 v76.44,10.4 76.44,9.4 | 76.44,9.4 v76.41,9.38 | v74.35,9.65 74.6,9.4 76.44,9.4
  Route2 0.406: v21.16,47.5 22.06,46.6 v22.06,34.95 20.76,33.65 20.76,24.15 | J2.13 3.82,9.56 v6.26,12 8.46,14.2 17.76,14.2 v20.76,17.2 20.76,24.15 | v44.36,24.2 20.81,24.2 20.76,24.15
  Bottom 0.2: J1.13 45.25,69.51 v48.66,66.1
  Bottom 0.203: v73.21,61.52 73.21,60.7 v73.23,60.67 v73.23,59.85 | v70.58,15.07 70.58,22.68 v70.26,23 | 25.81,16.6 25.81,16.8
  Bottom 0.305: 75.91,9.65 76.19,9.38 v76.41,9.38 | v25.81,15.15 25.81,16.6 27.16,17.95 v27.16,18 | v20.76,17.2 20.98,17.42 23.39,17.42 23.41,17.4 25.21,17.4 25.81,16.8 25.81,16.75
  Bottom 0.508: v27.11,32.95 27.11,35.3 27.16,35.35 27.61,35.8 v28.31,35.8
  Bottom 0.61: v77.16,11.48 77.16,10.13 76.68,9.65 75.91,9.65 v74.35,9.65 74.35,9.17 73.66,8.48 67.77,8.48 v67.44,8.15 | v22.06,34.95 22.46,35.35 27.16,35.35
  Bottom 0.813: v44.36,24.2 44.96,23.6 44.96,20.5 45.81,19.65 v46.86,19.65
  Bottom 1.016: v49.86,64.9 v50.46,65.5 v51.06,66.1 v50.46,66.7 v49.86,67.3 v49.26,66.7 v48.66,66.1 v49.86,64.9 | IC8.25 v49.26,65.5 v49.86,64.9
  other vias: 49.86,66.1
  pour Route2 (isolate 0.305): -5.14,78.25 85.37,78.25 85.37,-1.5 -5.14,-1.5
  pour Top (isolate 0.305): -5.44,78.65 84.64,78.65 84.64,-1.55 -5.44,-1.55
  pour Route15 (isolate 0.305): -4.79,79.2 85.92,79.2 85.92,-1.5 -4.79,-1.5
  pour Bottom (isolate 0.305): -4.49,79.65 86.47,79.65 86.47,-1.46 -4.49,-1.46
I2C0_SCL  (via drill 0.15)
  Top 0.2: IC2.7 62.48,55.61 63.52,56.64 63.52,59.6 v63.12,60 R38.1
  Top 0.203: v30.71,11.7 30.56,11.55 30.56,7.4 v30.76,7.2
  Bottom 0.203: v63.12,60 59.76,60 57.66,57.9 49.96,57.9 39.33,47.27 39.33,20.07 30.76,11.5 30.71,11.5 v30.71,11.7 | v30.76,7.2 30.76,3.53 J3.7
I2C0_SDA  (via drill 0.15)
  Top 0.2: IC2.6 62.88,55.55 63.91,56.57 v63.91,60.6 | R38.2 63.91,60.7
  Top 0.203: 63.91,60.7 v63.91,60.6 | v30.96,12.8 30.76,12.8 29.76,11.8 29.76,7 v30.06,6.7
  Bottom 0.203: v63.91,60.6 59.8,60.6 57.5,58.3 49.76,58.3 38.93,47.47 38.93,20.27 31.46,12.8 v30.96,12.8 | v30.06,6.7 30.26,6.5 30.26,3.59 J3.5
I2C1_SCL  (via drill 0.15)
  Top 0.2: IC2.5 63.28,55.51 64.26,56.49 64.26,59.67 v64.71,60.12 R38.3 | IC6.6 69.64,64.13 69.37,64.41 v68.25,64.41
  Bottom 0.2: v68.25,64.41 66.45,64.41 64.71,62.67 v64.71,60.12
I2C1_SDA  (via drill 0.15)
  Top 0.2: IC2.4 63.68,55.43 64.61,56.36 64.61,59.07 65.51,59.97 v65.51,60.47 R38.4 | IC6.5 70.14,64.39 69.8,64.74 v69.8,64.84
  Bottom 0.2: v69.8,64.84 68.71,63.75 66.78,63.75 65.51,62.48 v65.51,60.47
I_MEA/TX  (via drill 0.15)
  Top 0.2: IC2.40 64.08,46.95 63.58,46.45 63.58,43.23 65.01,41.8 v65.01,40.75 | v47.96,49.85 47.96,53.45 45.01,56.4 43.46,56.4 42.76,55.7 40.47,55.7 J1.4
  Top 0.305: R46.1 61.46,68.65 61.96,69.15 61.96,70.5 61.51,70.95 59.16,70.95 57.21,72.9 36.31,72.9 34.91,71.5 34.91,59.8 37.06,57.65 38.52,57.65 J1.4
  Bottom 0.2: v65.01,40.75 63.86,40.75 63.36,41.25 63.36,46.1 62.66,46.8 59.51,46.8 57.66,48.65 52.36,48.65 52.16,48.85 48.91,48.85 47.96,49.8 v47.96,49.85
KEY_0  (via drill 0.15)
  Top 0.203: IC2.15 58.84,54.57 58.38,55.02 v58.13,55.02
  Bottom 0.203: v58.13,55.02 57.33,55.83 56.36,55.83 55.44,54.9 49.57,54.9 41.6,46.92 41.6,19.38 29.21,6.99 J3.6
KEY_1  (via drill 0.15)
  Top 0.203: v56.88,54.33 57.72,53.49 IC2.16
  Bottom 0.203: v56.88,54.33 56.68,54.53 49.79,54.53 41.99,46.73 41.99,19.18 31.75,8.94 J3.8
KEY_2  (via drill 0.15)
  Top 0.203: v56.23,53.7 56.84,53.09 IC2.17
  Bottom 0.203: v56.23,53.7 55.79,54.14 49.96,54.14 42.38,46.56 42.38,19.01 34.29,10.92 J3.10
KEY_3  (via drill 0.15)
  Top 0.203: v55.56,53.05 55.92,52.69 IC2.18
  Bottom 0.203: v55.56,53.05 54.81,53.8 50.18,53.8 42.78,46.4 42.78,18.84 36.83,12.89 J3.12
N$1
  Top 0.2: IC1.10 57.08,30.93 58.19,29.82 R11.2
N$2
  Top 0.2: R9.2 60.26,25.18 60.26,12.95 54.46,7.15 54.46,3.45 53.3,2.29 ETH1.10
N$3
  Top 0.2: ETH1.12 61.23,2.42 59.36,4.3 55.66,4.3 54.78,5.17 54.78,6.88 60.66,12.75 60.66,26.05 60.53,26.18 59.43,26.18 R10.2
N$4
  Top 0.2: IC1.22 60.59,38.08 60.96,38.45 60.96,38.85 61.18,39.07 C6.1
N$5
  Top 0.2: IC1.20 61.56,37.08 C7.1
N$6
  Top 0.2: R12.1 48.64,41.39 47.12,41.39 47,41.27 X1.1 47,39.14 C8.1
N$7
  Top 0.2: R13.1 48.66,42.54 45.04,42.54 44.53,43.06 X1.3 44.53,45.05 C9.1
N$8  (via drill 0.15)
  Top 0.203: R12.2 51.04,41.37 v51.08,41.33 | v54.73,37.77 54.73,39.23 55.08,39.57 IC1.31
  Bottom 0.203: v51.08,41.33 51.66,40.75 51.66,38.73 52.36,38.02 54.48,38.02 v54.73,37.77
N$9  (via drill 0.15)
  Top 0.203: R13.2 51.04,42.52 v51.08,42.48 | v55.38,38.98 55.58,39.17 IC1.30
  Bottom 0.203: v51.08,42.48 52.03,41.52 52.03,38.95 52.56,38.42 55.16,38.42 55.38,38.65 v55.38,38.98
N$11
  Top 0.305: IC5.5 24.58,18.36 R41.2
N$12
  Top 0.305: 27.2,15.09 IC5.1
  Top 0.61: R45.2 R32.1 27.2,15.09
N$13
  Top 0.305: IC7.1 28.49,32.94 28.49,32.75
  Top 0.61: 28.49,32.75 R33.1 28.47,31.44 R29.2
N$14
  Top 0.2: R15.2 53.06,57 52.93,56.87 X2.3 | R16.1 51.46,56.69 X2.3 | C20.1 50.41,56.87 X2.3
N$15  (via drill 0.15)
  Top 0.305: R31.2 29.89,28.78 v29.86,28.75 | v24.71,34.23 v24.72,34.23 IC7.6
  Bottom 0.305: v29.86,28.75 29.86,28.9 26.11,32.65 26.11,33.8 25.76,34.15 24.8,34.15 v24.71,34.23
N$16  (via drill 0.15)
  Top 0.305: IC7.7 23.18,33.59 C49.1 23,33.6 v22.06,33.6 | R29.1 27.48,28.68 v27.46,28.7
  Bottom 0.305: v27.46,28.7 27.46,30.4 24.26,33.6 v22.06,33.6
N$17  (via drill 0.15)
  Top 0.2: IC2.26 58.3,49.49 56.81,48 53.01,48 51.46,46.45 45.91,46.45 44.11,48.25 44.11,53.75 44.51,54.15 v44.51,54.3 | v64.91,70.8 64.96,70.85 | 64.96,70.85 65.91,71.8 RESET.1 | R50.2 63.91,71.9 64.96,70.85
  Bottom 0.2: v44.51,54.3 44.51,54.9 51.81,62.2 62.41,62.2 64.91,64.7 v64.91,70.8
N$20
  Top 0.305: IC5.8 24.58,13.65 R42.1
N$21
  Top 0.305: 26.21,16.55 IC5.3 | 23.04,22.9 SW3.TP | 23.04,21.65 C42.2
  Top 0.61: L3.1 25.86,21.95 25.86,17.75 | 25.86,17.75 25.86,16.7 26,16.55 26.21,16.55 | 25.86,17.75 25.31,18.3 25.31,21 25.51,21.2 | 25.86,17.75 26.14,18.03 26.14,18.07 26.16,18.1 26.16,20.6 26.51,20.95 | 24.06,22.05 25.21,22.05 25.31,22.15 | 25.36,22.2 24.51,21.35 24.51,21.2
  Top 1.016: 26.16,21.85 26.16,24.25 23.66,24.25 24.06,23.85 24.06,22.05 23.76,22.35 23.04,22.35 | 26.16,21.85 25.51,21.2 24.51,21.2 24.06,21.2 23.61,21.65 23.04,21.65 23.04,22.35 | SW3.TP 23.12,23.55 25.36,23.55 25.36,22.2 25.31,22.15 24.76,22.7 24.76,22.85 | L3.1 26.59,22.28 26.16,21.85 | 23.04,22.35 23.04,22.9
N$22
  Top 0.305: C42.1 23.05,18.59 R41.1
N$23
  Top 0.2: R28.2 68.64,59.35 IC6.1 68.15,60.55 67.28,61.41 R27.1
N$24
  Top 0.61: R43.2 C43.2 21.76,11.86 | 21.76,11.86 R44.1 22.64,11.91 R42.2 | 21.76,11.86 21.76,9.04 VFB3.TP
N$26  (via drill 0.15)
  Top 0.305: R30.2 v28.92,11.61 v28.91,11.6 | v23.16,16.85 23.36,16.85 23.66,16.55 IC5.6
  Bottom 0.305: v28.91,11.6 28.91,11.55 27.36,11.55 24.46,14.45 24.46,16.1 23.71,16.85 v23.16,16.85
N$31  (via drill 0.15)
  Top 0.305: IC5.7 v23.26,15.91 21.84,15.91 C40.1 | R45.1 26.69,11.22 v26.21,11.7
  Bottom 0.305: v26.21,11.7 25.86,11.7 23.26,14.3 v23.26,15.91
N$33
  Top 0.305: IC7.5 R34.2
N$34
  Top 0.305: R35.1 25.45,32.94 IC7.8
N$35
  Top 0.203: 25.51,38.95 26.01,38.45 27.16,38.45 | L2.1 26.24,38.76 25.71,38.23
  Top 0.305: IC7.3 27.16,34.23 27.16,38.3 | 27.16,38.3 27.16,38.45 26.24,39.37 L2.1 26.24,42.27 25.86,42.65 23.11,42.65 22.63,42.17 SW5.TP 23.08,41.68 23.08,38.65 | 27.16,38.3 27.09,38.23 25.71,38.23 C51.2 23.08,38.65 | 23.08,38.65 23.43,39 24.06,39
  Top 1.27: 24.06,39 23.91,38.85 | 23.91,38.85 23.71,38.85 | 23.91,38.85 24.86,38.85 | 24.91,38.8 24.86,38.85 | 24.86,38.85 24.86,39.1 | 24.86,39.1 24.86,42.1 23.81,42.1 23.76,42.15 23.71,42.1 23.71,39.45 24.51,39.45 24.86,39.1 | 24.86,39.1 25.01,38.95 25.51,38.95
N$36
  Top 0.508: R34.1 C51.1
N$37
  Top 0.305: R35.2 24.15,30.11 R37.1 23.16,30.11 | 23.16,30.11 C52.2 22.41,30.11 R36.2 | 23.16,30.11 23.16,27.45 VFB5.TP
PWR_DETECT  (via drill 0.15)
  Top 0.203: IC2.41 64.48,46.82 63.96,46.3 63.96,43.5 65.65,41.81 v65.65,39.89 | v44.46,46.8 43.46,47.8 43.46,54.6 42.76,55.3 41.06,55.3 40.56,54.8 40.56,53.05 39.71,52.2 38.86,52.2 38.61,51.95 R49.2 R48.1 36.66,51 12VFB.TP
  Bottom 0.203: v65.65,39.89 63.67,39.89 62.56,41 62.56,45.8 62.06,46.3 59.36,46.3 58.36,47.3 52.56,47.3 51.86,46.6 44.66,46.6 v44.46,46.8
QSPI_SCLK
  Top 0.155: IC2.52 66.82,52.29 67.69,53.16 70.36,53.16 71.47,52.05 71.47,49.72 72.44,48.74 74.05,48.74 74.34,49.03 IC4.6
QSPI_SD0
  Top 0.155: IC2.53 66.88,52.69 67.59,53.4 70.46,53.4 71.71,52.15 71.71,49.82 72.29,49.23 72.85,49.23 73.08,49.46 IC4.5
QSPI_SD1
  Top 0.155: IC2.55 66.99,53.49 67.39,53.89 70.53,53.89 71.64,55 71.64,56.01 72.08,56.46 75.09,56.46 75.61,55.94 IC4.2
QSPI_SD2
  Top 0.155: IC2.54 66.93,53.09 67.49,53.65 70.63,53.65 71.88,54.9 71.88,55.91 72.19,56.22 74.14,56.22 74.34,56.01 IC4.3
QSPI_SD3
  Top 0.155: IC2.51 66.77,51.89 67.79,52.92 70.26,52.92 71.22,51.95 71.22,49.61 72.34,48.5 75.21,48.5 75.61,48.9 IC4.7
RCT
  Top 0.2: R6.1 57.28,22.73 56.98,23.03 54.37,23.03 54.04,23.03 53.78,22.77 R5.1 C1.1 53.78,17.48 55.24,16.02 ETH1.5
RD_N  (via drill 0.15)
  Top 0.121: C3.2 54.94,22.01 55.3,21.65 55.3,21.19 55.8,20.69 56.26,20.69 v56.26,20.43
  Bottom 0.121: v56.26,20.43 56.26,20.69 55.72,20.69 55.27,20.24 55.27,20.21 arc90 55.42,20.06 55.84,20.06 arc-90 56.3,19.59 56.3,19.55 arc-90 55.84,19.08 54.48,19.08 arc90 54.32,18.92 54.32,18.88 arc90 54.48,18.72 55.84,18.72 arc-90 56.3,18.25 56.3,18.21 arc-90 55.84,17.74 54.38,17.74 arc90 54.23,17.59 54.23,17.54 arc90 54.38,17.39 55.84,17.39 arc-90 56.3,16.92 56.3,16.87 arc-90 55.84,16.41 55.42,16.41 arc90 55.27,16.25 55.27,15.35 55.38,15.24 ETH1.6
RD_P  (via drill 0.15)
  Top 0.121: C4.2 56.14,22.07 55.62,21.55 55.62,21.31 55.92,21.01 56.26,21.01 v56.26,21.27
  Bottom 0.121: v56.26,21.27 56.26,21.01 55.6,21.01 54.95,20.36 54.95,20.21 arc90 55.42,19.75 55.84,19.75 arc-90 55.99,19.59 55.99,19.55 arc-90 55.84,19.39 54.38,19.39 arc90 53.91,18.92 53.91,18.88 arc90 54.38,18.41 55.84,18.41 arc-90 55.99,18.25 55.99,18.21 arc-90 55.84,18.05 54.38,18.05 arc90 53.91,17.59 53.91,17.54 arc90 54.38,17.07 55.84,17.07 arc-90 55.99,16.92 55.99,16.87 arc-90 55.84,16.72 55.42,16.72 arc90 54.95,16.25 54.95,15.3 54.89,15.24 ETH1.4
RDC_RD_N
  Top 0.121: R4.2 55.12,25.45 55.4,25.17 55.4,24 55.09,23.69 C3.1 53.8,23.69 R5.2
RDC_RD_P
  Top 0.121: R3.2 56.02,25.47 55.72,25.17 55.72,23.95 56,23.67 C4.1 R6.2
REL_0
  Top 0.2: J1.12 40.69,68.3 48.01,68.3 IC8.15
REL_1
  Top 0.2: J1.11 42.83,67.9 47.71,67.9 IC8.16
REL_2
  Top 0.2: IC8.17 47.5,67.4 43.86,67.4 42.46,66 40.93,66 J1.10
REL_3
  Top 0.2: J1.9 41.9,64.84 43.96,66.9 47.29,66.9 IC8.18
REL_4
  Top 0.2: IC8.19 45.49,63.5 40.97,63.5 J1.8
REL_5
  Top 0.2: IC8.20 45.8,63.1 43.11,63.1 J1.7
REL_6
  Top 0.2: IC8.21 46.01,62.6 44.56,62.6 42.66,60.7 40.71,60.7 J1.6
REL_7
  Top 0.2: IC8.22 46.31,62.2 44.86,62.2 42.01,59.35 J1.5
RP_XI
  Top 0.2: C19.1 54.25,55.32 | 54.25,55.32 54.13,55.32 53.82,55.01 53.82,53.06 55,51.89 IC2.20 | X2.1 55.6,59.32 54.25,59.32 | 54.25,59.32 54.25,55.32 | 54.25,59.32 54.25,60.74 R15.1
RP_XO
  Top 0.2: R16.2 53.17,55.32 53.46,55.03 53.46,52.8 54.77,51.49 IC2.21
RX_RD_N
  Top 0.121: IC1.5 54.58,30.87 54.65,30.8 54.65,28.19 55.35,27.49 55.35,26.98 55.12,26.75 R4.1
RX_RD_P
  Top 0.121: IC1.6 55.08,30.92 54.97,30.8 54.97,28.31 55.72,27.56 55.72,27.07 56.02,26.77 R3.1
SPI0_MISO
  Top 0.203: IC2.27 58.44,49.09 56.99,47.64 56.65,47.64 55.21,46.2 55.21,44.38 53.58,42.75 IC1.34
SPI0_MOSI  (via drill 0.15)
  Top 0.203: IC1.35 53.08,42.87 54.58,44.38 v54.58,44.62 | IC2.30 60.08,47.12 59.61,46.65 57.13,46.65 56.53,46.05 v56.53,45.3
  Bottom 0.203: v56.53,45.3 55.26,45.3 v54.58,44.62
SPI0_SCK  (via drill 0.15)
  Top 0.203: IC1.33 54.08,42.57 54.76,43.25 v54.81,43.25 | IC2.29 59.68,47.37 59.31,47 56.93,47 55.91,45.98 55.91,44.83 56.13,44.6 v56.13,44.5
  Bottom 0.203: v56.13,44.5 56.06,44.5 v54.81,43.25
SPI1_MISO  (via drill 0.15)
  Top 0.2: v59.98,57.6 59.98,57.94 59.34,58.58 59.34,64.22 53.96,69.6 51.59,69.6 IC8.12
  Top 0.203: IC2.11 60.88,56.7 v59.98,57.6
  Bottom 0.203: v59.98,57.6 58.41,57.6 57.98,57.17 50.26,57.17 40.18,47.09 40.18,19.64 31.18,10.65 16.09,10.65 11.44,6 J2.7
SPI1_MOSI  (via drill 0.15)
  Top 0.2: IC8.11 51.7,69 v51.96,69 | v57.56,64.5 57.56,63.7 58.16,63.1 58.16,56.52 v58.51,56.17
  Top 0.203: IC2.14 59.68,55.01 v58.51,56.17
  Bottom 0.2: v51.96,69 52.26,69 52.86,68.4 54.56,68.4 57.76,65.2 57.76,64.7 v57.56,64.5
  Bottom 0.203: v58.51,56.17 50.33,56.17 41.15,46.99 41.15,19.55 31.41,9.8 16.31,9.8 13.98,7.47 J2.5
SPI1_SCK  (via drill 0.15)
  Top 0.2: IC8.10 51.81,68.4 52.56,68.4 v53.16,69 | v58.26,63.9 58.56,63.6 58.56,57.33 v59.13,56.75
  Top 0.203: IC2.13 60.08,55.8 v59.13,56.75
  Bottom 0.2: v53.16,69 53.36,68.8 54.66,68.8 58.26,65.2 v58.26,63.9
  Bottom 0.203: v59.13,56.75 59.11,56.77 50.43,56.77 40.7,47.05 40.7,19.59 31.33,10.22 16.16,10.22 12.96,7.03 12.96,5.05 11.94,4.03 9.94,4.03 J2.9
SWCLK
  Top 0.2: IC2.24 58,50.29 56.46,48.75 53.41,48.75 53.08,49.08 53.08,50.88 51.2,52.76 DBG2.1
SWDIO
  Top 0.2: DBG2.3 51.29,48.35 56.61,48.35 58.15,49.89 IC2.25
TCT
  Top 0.2: C2.1 49.5,18.38 R40.1 51.43,16.45 ETH1.2
TD_N  (via drill 0.15)
  Top 0.121: R8.1 R1.2 51.95,25.08 51.95,21.91 51.7,21.66 51.16,21.66 v51.16,21.92
  Bottom 0.121: v51.16,21.92 51.16,21.66 52.02,21.66 52.82,20.86 52.82,20.2 arc-90 52.35,19.73 51.54,19.73 arc90 51.38,19.57 51.38,19.17 arc90 51.54,19.02 52.35,19.02 arc-90 52.82,18.55 52.82,14.64 51.62,13.44 51.62,13.05 51.97,12.7 ETH1.3
TD_P  (via drill 0.15)
  Top 0.121: R7.1 R2.2 52.27,25.06 52.27,21.79 51.82,21.34 51.16,21.34 v51.16,21.08
  Bottom 0.121: v51.16,21.08 51.16,21.34 51.9,21.34 52.5,20.74 52.5,20.2 arc-90 52.35,20.04 51.54,20.04 arc90 51.07,19.57 51.07,19.17 arc90 51.54,18.71 52.35,18.71 arc-90 52.5,18.55 52.5,14.76 51.3,13.56 51.3,13.05 50.95,12.7 ETH1.1
TX_TD_N
  Top 0.121: IC1.1 52.58,31.02 52.65,30.95 52.65,28.41 51.95,27.71 51.95,27.04 51.67,26.76 R1.1
TX_TD_P
  Top 0.121: IC1.2 53.08,31.07 52.97,30.95 52.97,28.29 52.32,27.64 52.32,27.04 52.59,26.77 R2.1
UART0_RX
  Top 0.2: IC2.2 64.48,55.22 66.81,57.55 71.11,57.55 72.01,58.45 72.01,64.35 73.21,65.55 75.51,65.55 76.58,66.62 DBG1.1
  Top 0.305: R47.2 62.91,69.55 73.95,69.55 DBG1.1
UART0_TX
  Top 0.2: IC2.3 64.08,55.32 66.71,57.95 70.91,57.95 71.61,58.65 71.61,66.81 DBG1.3
  Top 0.305: R46.2 62.91,68.95 70.46,68.95 71.5,67.91 DBG1.3
USB_BOOT
  Top 0.2: USB_BOOT.1 78.54,60.1 R19.1
USB_DP_N
  Top 0.155: IC2.46 66.59,49.89 66.62,49.92 69.57,49.92 72.29,47.21 74.1,47.21 74.85,46.45 74.85,29 arc90 75.37,28.48 75.68,28.48 arc-90 75.85,28.31 75.85,28.17 arc-90 75.68,28 75.37,28 arc90 74.85,27.48 74.85,27.35 arc90 75.37,26.83 75.68,26.83 arc-90 75.85,26.66 75.85,26.52 arc-90 75.68,26.35 75.37,26.35 arc90 74.85,25.83 74.85,24 74.74,23.89 R21.2
USB_DP_P
  Top 0.155: IC2.47 66.6,50.29 66.62,50.27 69.72,50.27 72.44,47.55 74.24,47.55 75.2,46.59 75.2,29 arc90 75.37,28.83 75.68,28.83 arc-90 76.2,28.31 76.2,28.17 arc-90 75.68,27.66 75.66,27.66 arc90 75.49,27.48 75.49,27.35 arc90 75.66,27.18 75.68,27.18 arc-90 76.2,26.66 76.2,26.52 arc-90 75.68,26 75.37,26 arc90 75.2,25.83 75.2,23.9 75.21,23.89 R22.2
USB_SHIELD
  Top 0.406: USBC.S3 69.34,1.2 69.82,0.72 77.24,0.72 77.98,1.46 USBC.S4
  Top 0.61: C54.1 R39.1 78.63,8.12 77.98,7.47 USBC.S2 USBC.S4 | USBC.S1 USBC.S3
V_MEA/RX  (via drill 0.15)
  Top 0.2: J1.3 45.25,56.81 49.11,52.95 49.06,52.9 v49.06,50.15 | v64.26,41.55 63.28,42.53 63.28,46.65 63.68,47.05 IC2.39
  Top 0.305: R47.1 60.76,70.4 58.81,70.4 56.81,72.4 36.66,72.4 35.36,71.1 35.36,60.05 37.26,58.15 40.66,58.15 41.9,56.91 J1.3
  Bottom 0.2: v49.06,50.15 49.96,49.25 53.41,49.25 53.6,49.06 54.02,49.06 54.21,49.25 57.81,49.25 59.81,47.25 62.76,47.25 63.76,46.25 63.76,42.05 v64.26,41.55
V_USB
  Top 0.203: R26.1 66.29,38.52 62.88,41.93 62.88,46.75 63.28,47.15 IC2.38
  Top 0.61: R26.1 67.69,14.37 R25.2
VBUS  (via drill 0.15)  (1 unrouted)
  Top 0.2: USBC.B9 71.25,7.29 USBC.A4 | USBC.B4 USBC.A9
  Top 0.305: 75.94,7.26 USBC.B4
  Top 0.406: v69.01,15.75 R25.1
  Top 0.61: ESD1.4 71.8,10.48 71.22,9.91 | 71.22,9.91 C26.1 69.78,10.88 R20.1 C27.1 69,12.98 R25.1 | 71.22,9.91 71.25,9.88 71.25,7.29
  Bottom 0.203: VBUS.TP 64.91,17.1 66.26,15.75 v69.01,15.75
  other vias: 64.91,20.21
VREF
  Top 0.2: IC3.3 73.5,41.83 R17.1
  Top 0.203: VREF.TP 73.31,37.85 74.46,39 74.46,41.8 74.26,42 73.68,42 R17.1
  Top 0.61: 72.05,42.11 72.17,41.98 | 72.17,41.98 73.18,41.98 | 73.18,41.98 R17.1 73.71,42.03 C22.1 | C22.1 72.87,43.96 | 72.87,43.96 C21.1 | C22.1 73.18,43.43 73.18,41.98 | 72.19,41.98 72.87,42.66 72.87,43.96 | C21.1 72.57,42.63 72.05,42.11 | 72.05,42.11 71.93,41.99 71.88,42.04 71.88,43.03 71.26,43.66 REF1.1 72.27,43.66 C21.1 | 72.17,41.98 72.17,43.56 C21.1

## Text on the board
tPlace: Controller Board REV 1.1
bNames: github.com/DvidMakesThings/HW_10-In-Rack_PDU / David Sipos @2025